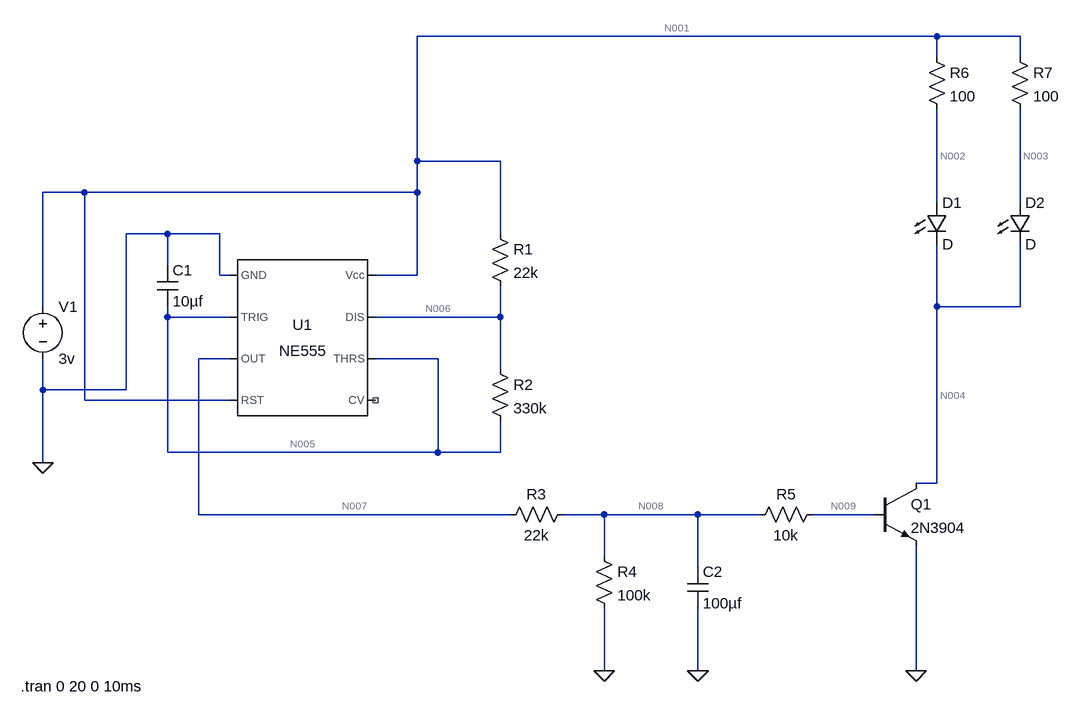
[diagram p0: schematic 555_badge.asc]
555_badge.asc, the LTspice schematic file:
Version 4
SHEET 1 1316 680
WIRE 1072 -336 272 -336
WIRE 1200 -336 1072 -336
WIRE 1072 -304 1072 -336
WIRE 1200 -304 1200 -336
WIRE 272 -144 272 -336
WIRE 400 -144 272 -144
WIRE -240 -96 -304 -96
WIRE 272 -96 272 -144
WIRE 272 -96 -240 -96
WIRE 1072 -80 1072 -224
WIRE 1200 -80 1200 -224
WIRE -112 -32 -176 -32
WIRE -32 -32 -112 -32
WIRE 400 -32 400 -144
WIRE -112 16 -112 -32
WIRE -32 32 -32 -32
WIRE -16 32 -32 32
WIRE 272 32 272 -96
WIRE 272 32 208 32
WIRE -304 80 -304 -96
WIRE 1072 80 1072 -16
WIRE 1200 80 1200 -16
WIRE 1200 80 1072 80
WIRE -112 96 -112 80
WIRE -16 96 -112 96
WIRE 400 96 400 48
WIRE 400 96 208 96
WIRE -16 160 -64 160
WIRE 304 160 208 160
WIRE 400 176 400 96
WIRE -304 208 -304 160
WIRE -176 208 -176 -32
WIRE -176 208 -304 208
WIRE -240 224 -240 -96
WIRE -16 224 -240 224
WIRE -112 304 -112 96
WIRE 304 304 304 160
WIRE 304 304 -112 304
WIRE 400 304 400 256
WIRE 400 304 304 304
WIRE -304 320 -304 208
WIRE 1072 352 1072 80
WIRE 1072 352 1040 352
WIRE -64 400 -64 160
WIRE 416 400 -64 400
WIRE 560 400 496 400
WIRE 704 400 560 400
WIRE 800 400 704 400
WIRE 976 400 880 400
WIRE 560 464 560 400
WIRE 704 480 704 400
WIRE 560 640 560 544
WIRE 704 640 704 544
WIRE 1040 640 1040 448
FLAG -304 320 0
FLAG 560 640 0
FLAG 704 640 0
FLAG 1040 640 0
SYMBOL Misc\\NE555 96 128 R0
SYMATTR InstName U1
SYMBOL voltage -304 64 R0
WINDOW 123 0 0 Left 0
WINDOW 39 0 0 Left 0
SYMATTR InstName V1
SYMATTR Value 3v
SYMBOL cap -128 16 R0
SYMATTR InstName C1
SYMATTR Value 10µf
SYMBOL res 384 -48 R0
SYMATTR InstName R1
SYMATTR Value 22k
SYMBOL res 384 160 R0
SYMATTR InstName R2
SYMATTR Value 330k
SYMBOL res 512 384 R90
WINDOW 0 0 56 VBottom 2
WINDOW 3 32 56 VTop 2
SYMATTR InstName R3
SYMATTR Value 22k
SYMBOL res 544 448 R0
SYMATTR InstName R4
SYMATTR Value 100k
SYMBOL res 896 384 R90
WINDOW 0 0 56 VBottom 2
WINDOW 3 32 56 VTop 2
SYMATTR InstName R5
SYMATTR Value 10k
SYMBOL res 1056 -320 R0
SYMATTR InstName R6
SYMATTR Value 100
SYMBOL res 1184 -320 R0
SYMATTR InstName R7
SYMATTR Value 100
SYMBOL npn 976 352 R0
SYMATTR InstName Q1
SYMATTR Value 2N3904
SYMBOL LED 1056 -80 R0
SYMATTR InstName D1
SYMBOL LED 1184 -80 R0
SYMATTR InstName D2
SYMBOL cap 688 480 R0
SYMATTR InstName C2
SYMATTR Value 100µf
TEXT -338 664 Left 2 !.tran 0 20 0 10ms

The netlist it stands for:
* 555_badge.asc
XU1 0 N005 N007 N001 NC_01 N005 N006 N001 NE555  ; pins GND TRIG OUT RST CV THRS DIS Vcc
V1 N001 0 3v
C1 0 N005 10µf
R1 N001 N006 22k
R2 N006 N005 330k
R3 N008 N007 22k
R4 N008 0 100k
R5 N009 N008 10k
R6 N001 N002 100
R7 N001 N003 100
Q1 N004 N009 0 0 2N3904
D1 N002 N004 D
D2 N003 N004 D
C2 N008 0 100µf
.model D D
.lib standard.dio
.model NPN NPN
.model PNP PNP
.lib standard.bjt
.tran 0 20 0 10ms
.lib NE555.sub
.backanno
.end

* Results of the author's LTspice run, read from the files saved beside the schematic
* Operating Point, zero values left out:
*   V(n005) = 2.998 V
*   V(n001) = 3 V
*   V(n006) = 3 V
*   V(n007) = 3 V
*   V(n008) = 1.349 V
*   V(n009) = 733.5 mV
*   V(n002) = 2.11 V
*   V(n003) = 2.11 V
*   V(n004) = 1.398 V
*   Ic(Q1) = 17.8 mA
*   Ib(Q1) = 61.54 µA
*   Ie(Q1) = -17.86 mA
*   I(D2) = 8.899 mA
*   I(D1) = 8.899 mA
*   I(R7) = 8.899 mA
*   I(R6) = 8.899 mA
*   I(R5) = -61.54 µA
*   I(R4) = 13.49 µA
*   I(R3) = -75.03 µA
*   I(R2) = 5.996 nA
*   I(R1) = 9.998 nA
*   I(V1) = -18.83 mA
*   Ix(u1:1) = -962.3 µA
*   Ix(u1:2) = 2.998 nA
*   Ix(u1:3) = -75.03 µA
*   Ix(u1:4) = 9.333 µA
*   Ix(u1:6) = 2.998 nA
*   Ix(u1:7) = 4.003 nA
*   Ix(u1:8) = 1.028 mA
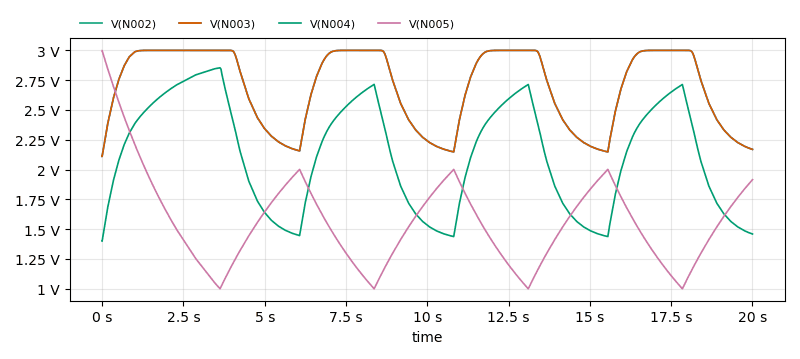
[diagram p1: Transient Analysis of 555_badge.asc, plotted from the saved traces]
* Transient Analysis, 1 run:
*   V(N002): min 2.11 V, max 3 V, average 2.696 V, rms 2.716 V, last 2.169 V
*   V(N003): min 2.11 V, max 3 V, average 2.696 V, rms 2.716 V, last 2.169 V
*   V(N004): min 1.398 V, max 2.854 V, average 2.125 V, rms 2.174 V, last 1.459 V
*   V(N005): min 999 mV, max 2.998 V, average 1.56 V, rms 1.605 V, last 1.915 V